# EAGLE design Digital_Level_LEDboard_T01_v2 (EAGLE 7.4.0)
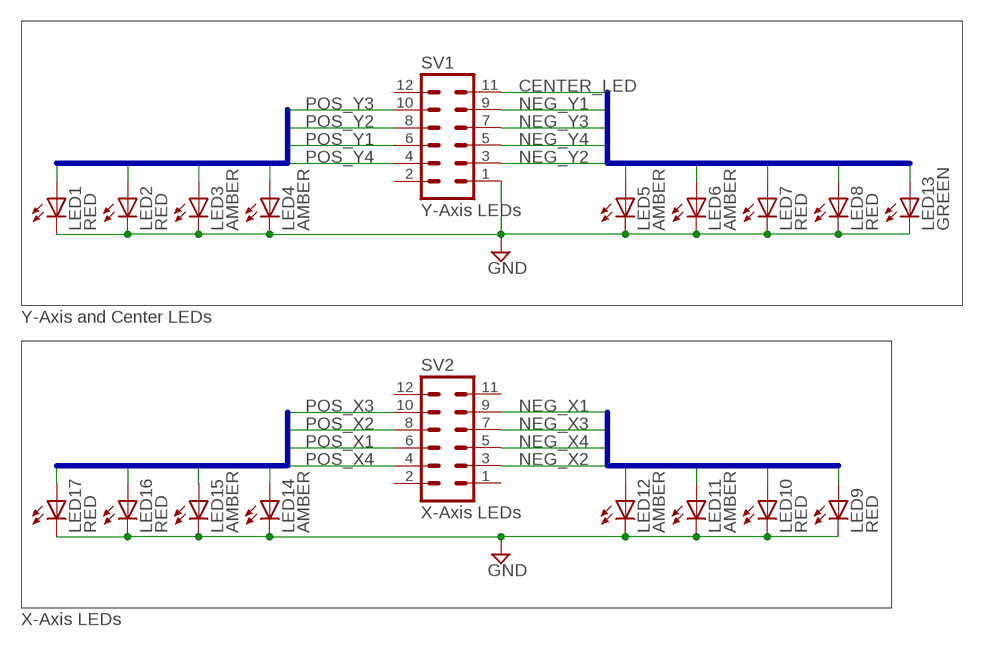
[diagram p0: schematic, sheet 1]

## Parts
LED1  RED  LED5MM  [LED5MM]
LED2  RED  LED5MM  [LED5MM]
LED3  AMBER  LED5MM  [LED5MM]
LED4  AMBER  LED5MM  [LED5MM]
LED5  AMBER  LED5MM  [LED5MM]
LED6  AMBER  LED5MM  [LED5MM]
LED7  RED  LED5MM  [LED5MM]
LED8  RED  LED5MM  [LED5MM]
LED9  RED  LED5MM  [LED5MM]
LED10  RED  LED5MM  [LED5MM]
LED11  AMBER  LED5MM  [LED5MM]
LED12  AMBER  LED5MM  [LED5MM]
LED13  GREEN  LED5MM  [LED5MM]
LED14  AMBER  LED5MM  [LED5MM]
LED15  AMBER  LED5MM  [LED5MM]
LED16  RED  LED5MM  [LED5MM]
LED17  RED  LED5MM  [LED5MM]
SV1  Y-Axis LEDs  MA06-2  [MA06-2]
SV2  X-Axis LEDs  MA06-2  [MA06-2]

## Nets
CENTER_LED: LED13.A SV1.11
GND: LED1.K(C) LED2.K(C) LED3.K(C) LED4.K(C) LED5.K(C) LED6.K(C) LED7.K(C) LED8.K(C) LED9.K(C) LED10.K(C) LED11.K(C) LED12.K(C) LED13.K(C) LED14.K(C) LED15.K(C) LED16.K(C) LED17.K(C) SV1.1
NEG_X1: LED12.A SV2.9
NEG_X2: LED11.A SV2.3
NEG_X3: LED10.A SV2.7
NEG_X4: LED9.A SV2.5
NEG_Y1: LED5.A SV1.9
NEG_Y2: LED6.A SV1.3
NEG_Y3: LED7.A SV1.7
NEG_Y4: LED8.A SV1.5
POS_X1: LED14.A SV2.6
POS_X2: LED15.A SV2.8
POS_X3: LED16.A SV2.10
POS_X4: LED17.A SV2.4
POS_Y1: LED4.A SV1.6
POS_Y2: LED3.A SV1.8
POS_Y3: LED2.A SV1.10
POS_Y4: LED1.A SV1.4
Unconnected: SV1.2 SV1.12 SV2.1 SV2.2 SV2.11 SV2.12

## Buses
POS_Y1,POS_Y2,POS_Y3,POS_Y4
CENTER_LED,POS_X1,POS_X2,POS_X3,POS_X4
NEG_X1,NEG_X2,NEG_X3,NEG_X4
NEG_Y1,NEG_Y2,NEG_Y3,NEG_Y4,CENTER_LED

## Notes on the sheet
- Y-Axis and Center LEDs
- X-Axis LEDs

## Library data of the parts
LED1-LED17 = adafruit:LED: LED OSRAM: - CHIPLED LG R971, LG N971, LY N971, LG Q971, LY Q971, LO R971, LY R971 LH N974, LH R974 LS Q976, LO Q976, LY Q976 LO Q996 - Hyper CHIPLED LW Q18S LB Q993, LB Q99A, LB R99A - SideLED LS A670, LO A670, LY A670, LG A670, LP A670 LB A673, LV A673, LT A673, LW A673 LH A674 LY A675 LS A676, LA A676, LO A676, LY A676, LW A676 LS A679, LY A679, LG A679 - Hyper Micro SIDELED® LS Y876, LA Y876, LO Y876, LY Y876 LT Y87S - SmartLED LW L88C, LW L88S LB L89C, LB L89S, LG L890 LS L89K, LO L89K, LY L89K LS L896, LA L896, LO L896, LY L896 - TOPLED LS T670, LO T670, LY T670, LG T670, LP T670 LSG T670, LSP T670, LSY T670, LOP T670, LYG T670 LG T671, LOG T671, LSG T671 LB T673, LV T673, LT T673, LW T673 LH T674 LS T676, LA T676, LO T676, LY T676, LB T676, LH T676, LSB T676, LW T676 LB T67C, LV T67C, LT T67C, LS T67K, LO T67K, LY T67K, LW E67C LS E67B, LA E67B, LO E67B, LY E67B, LB E67C, LV E67C, LT E67C LW T67C LS T679, LY T679, LG T679 LS T770, LO T770, LY T770, LG T770, LP T770 LB T773, LV T773, LT T773, LW T773 LH T774 LS E675, LA E675, LY E675, LS T675 LS T776, LA T776, LO T776, LY T776, LB T776 LHGB T686 LT T68C, LB T68C - Hyper Mini TOPLED® LB M676 - Mini TOPLED Santana® LG M470 LS M47K, LO M47K, LY M47K Source: http://www.osram.convergy.de/
SV1 SV2 = con-lstb:MA06-2: PIN HEADER; OC_FARNELL: unknown; OC_NEWARK: unknown

## Board
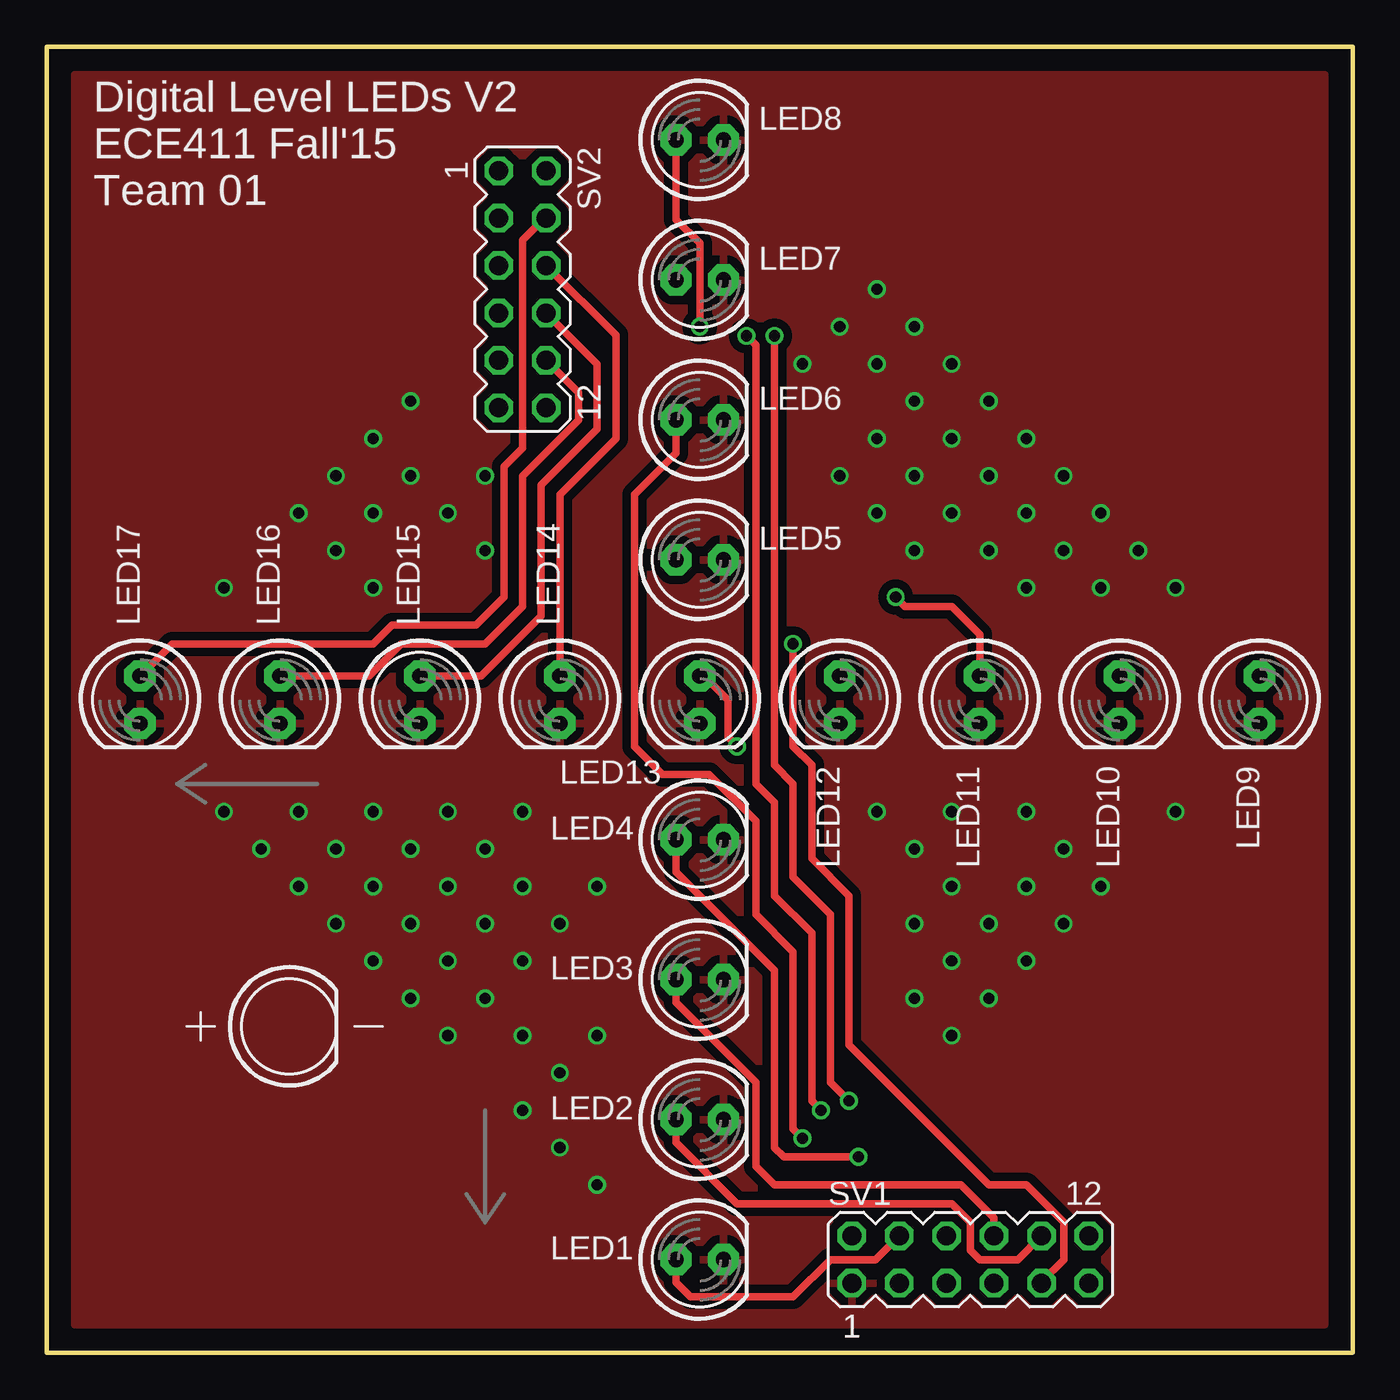
[diagram p1: board, top side]
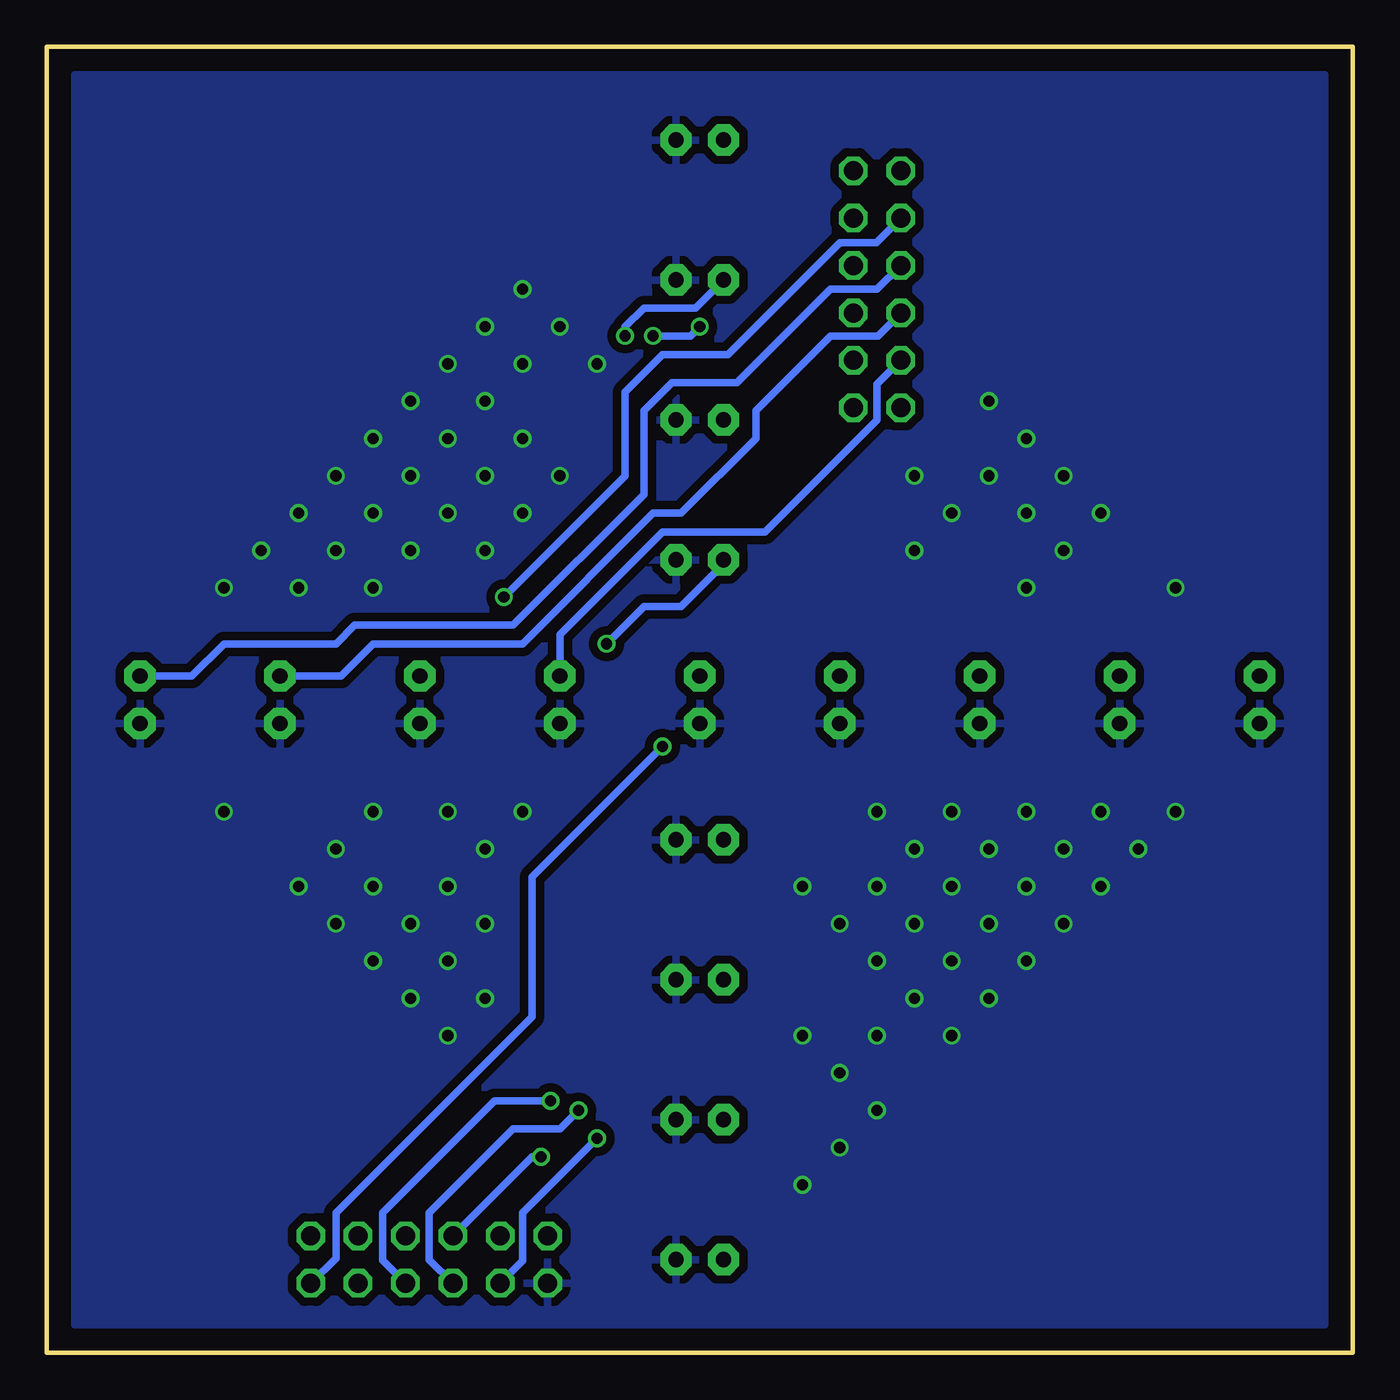
[diagram p2: board, bottom side, seen from below]

Size 70 x 70 mm. Coordinates in mm from the lower left corner, seen from the top.
Outline: 0,0 70,0 70,70 0,70 0,0
Copper layers (1*16): Top 0.0356mm / dielectric 1.5011mm / Bottom 0.0356mm
Design rules "LaenPCBOrder *": minimum track width 6mil, minimum drill 13mil, track to track 6mil, track to pad 6mil, pad to pad 6mil, via to via 6mil, smd to smd 6mil, copper to edge 15mil, drill to drill 6mil, minimum pad ring 7mil, minimum via ring 7mil, stop-mask expansion 3mil, vias tented up to drill 24mil, thermal gap 18mil

### Footprints (pad centres in the part's own frame; a part is rotated, then mirrored left to right if it is on the bottom)
LED5MM = drill 0.813 pad 1.676 octagon: A -1.27,0; K 1.27,0
MA06-2 = drill 1.016 octagon: 1 -6.35,-1.27; 2 -6.35,1.27; 3 -3.81,-1.27; 4 -3.81,1.27; 5 -1.27,-1.27; 6 -1.27,1.27; 7 1.27,-1.27; 8 1.27,1.27; 9 3.81,-1.27; 10 3.81,1.27; 11 6.35,-1.27; 12 6.35,1.27

### Placement (x,y rotation side)
LED1  35,5 0 top
LED2  35,12.5 0 top
LED3  35,20 0 top
LED4  35,27.5 0 top
LED5  35,42.5 0 top
LED6  35,50 0 top
LED7  35,57.5 0 top
LED8  35,65 0 top
LED9  65,35 270 top
LED10  57.5,35 270 top
LED11  50,35 270 top
LED12  42.5,35 270 top
LED13  35,35 270 top
LED14  27.5,35 270 top
LED15  20,35 270 top
LED16  12.5,35 270 top
LED17  5,35 270 top
SV1  49.5,5 0 top
SV2  25.5,57 270 top

### Tracks (layer width: path | path; a pad name or v marks a point on that pad's centre or on a via)
CENTER_LED  (via drill 0.6)
  Top 0.406: LED13.A 35.23,36.27 36.5,35 36.5,33 v37,32.5
  Bottom 0.406: SV1.11 54.5,5.08 54.5,7.5 44,18 44,25.5 v37,32.5
GND  (via drill 0.6)
  other vias: 42.5,47 44.5,45 46.5,47 48.5,45 46.5,43 50.5,43 50.5,47 52.5,45 54.5,43 54.5,47 56.5,45 58.5,43 56.5,41 52.5,41 60.5,41 48.5,49 44.5,49 46.5,51 44.5,53 42.5,55 40.5,53 52.5,49 50.5,51 48.5,53 46.5,55 44.5,57 60.5,29 52.5,29 48.5,29 54.5,27 48.5,25 46.5,19 52.5,25 54.5,23 52.5,21 50.5,23 48.5,21 50.5,19 48.5,17 56.5,25 46.5,27 46.5,23 44.5,29 9.5,29 11.5,27 13.5,29 13.5,25 15.5,27 17.5,29 17.5,25 19.5,27 21.5,29 21.5,25 23.5,27 25.5,29 25.5,25 23.5,23 19.5,23 15.5,23 17.5,21 21.5,21 25.5,21 29.5,25 27.5,23 29.5,17 27.5,15 25.5,17 23.5,19 21.5,17 19.5,19 25.5,13 27.5,11 29.5,9 9.5,41 13.5,45 15.5,47 17.5,49 19.5,51 15.5,43 17.5,45 19.5,47 17.5,41 21.5,45 23.5,43 23.5,47
  pour Top (isolate 0.457): 1.5,1.5 1.5,68.5 68.5,68.5 68.5,1.5
  pour Bottom (isolate 0.457): 1.5,1.5 1.5,68.5 68.5,68.5 68.5,1.5
NEG_X1
  Bottom 0.406: SV2.9 25.5,51.92 25.5,50 31.5,44 37,44 42.5,38.5 LED12.A
NEG_X2  (via drill 0.6)
  Top 0.406: LED11.A 50,38.5 48.5,40 46,40 v45.5,40.5
  Bottom 0.406: SV2.3 25.54,59.5 27.5,59.5 33.5,53.5 37,53.5 39,51.5 39,47 v45.5,40.5
NEG_X3
  Bottom 0.406: SV2.7 25.46,54.5 28,54.5 32,50.5 32,49 36,45 37.5,45 44.5,38 52.5,38 54.23,36.27 LED10.A
NEG_X4
  Bottom 0.406: SV2.5 25.5,57 28,57 33,52 36.5,52 38,50.5 38,46 45,39 53.5,39 54.5,38 60.5,38 62.23,36.27 LED9.A
NEG_Y1  (via drill 0.6)
  Top 0.406: SV1.9 53.31,3.81 54.5,5 54.5,7 52.5,9 50.5,9 43,16.5 43,24.5 41,26.5 41,31.5 40,32.5 v40,38
  Bottom 0.406: v40,38 38,40 36,40 33.73,42.27 LED5.A
NEG_Y2  (via drill 0.6)
  Top 0.406: v40.5,11.5 40,12 40,21.5 38,23.5 38,28.5 35.5,31 33,31 31.5,32.5 31.5,46 33.73,48.23 LED6.A
  Bottom 0.406: SV1.3 44.5,4.92 44.5,7.5 v40.5,11.5
NEG_Y3  (via drill 0.6)
  Top 0.406: v43,13.5 42,14.5 42,23.5 40,25.5 40,30.5 39,31.5 v39,54.5
  Bottom 0.406: SV1.7 52,4.96 52,7.5 46,13.5 v43,13.5 | LED7.A 35.23,56 38,56 39,55 v39,54.5
NEG_Y4  (via drill 0.6)
  Top 0.406: v41.5,13 41,13.5 41,22.5 39,24.5 39,29.5 38,30.5 38,54 v37.5,54.5 | LED8.A 33.73,60.73 35,59.46 v35,55
  Bottom 0.406: SV1.5 49.5,5 49.5,7.5 45,12 42.5,12 v41.5,13 | v35,55 35.5,54.5 v37.5,54.5
POS_X1
  Top 0.406: SV2.6 30.5,54.54 30.5,49 27.5,46 LED14.A
POS_X2
  Top 0.406: SV2.8 29.5,53 29.5,49.5 26.5,46.5 26.5,39.5 23.27,36.27 LED15.A
POS_X3
  Top 0.406: SV2.10 28.5,51.46 28.5,50 25.5,47 25.5,40 23.5,38 19,38 17.27,36.27 LED16.A
POS_X4
  Top 0.406: SV2.4 26.69,60.81 25.5,59.62 25.5,48.5 24.5,47.5 24.5,40.5 23,39 18.5,39 17.5,38 6.73,38 LED17.A
POS_Y1  (via drill 0.6)
  Top 0.406: LED4.A 33.73,25.77 39,20.5 39,11 39.5,10.5 v43.5,10.5
  Bottom 0.406: v43.5,10.5 44,10.5 SV1.6
POS_Y2
  Top 0.406: LED3.A 33.73,18.77 38,14.5 38,10 39,9 49,9 50.77,7.23 SV1.8
POS_Y3
  Top 0.406: LED2.A 33.73,11.27 37,8 48.5,8 49.5,7 49.5,5.5 50,5 52.04,5 SV1.10
POS_Y4
  Top 0.406: LED1.A 33.73,3.77 34.5,3 40,3 42,5 44.42,5 SV1.4

### Text on the board
tPlace: Digital Level LEDs V2 | ECE411 Fall'15 | Team 01
tDocu: +X | +Y